# EAGLE design MRCS-SIGNAL-COMMON-DISTRIBUTION (EAGLE 7.7.0)
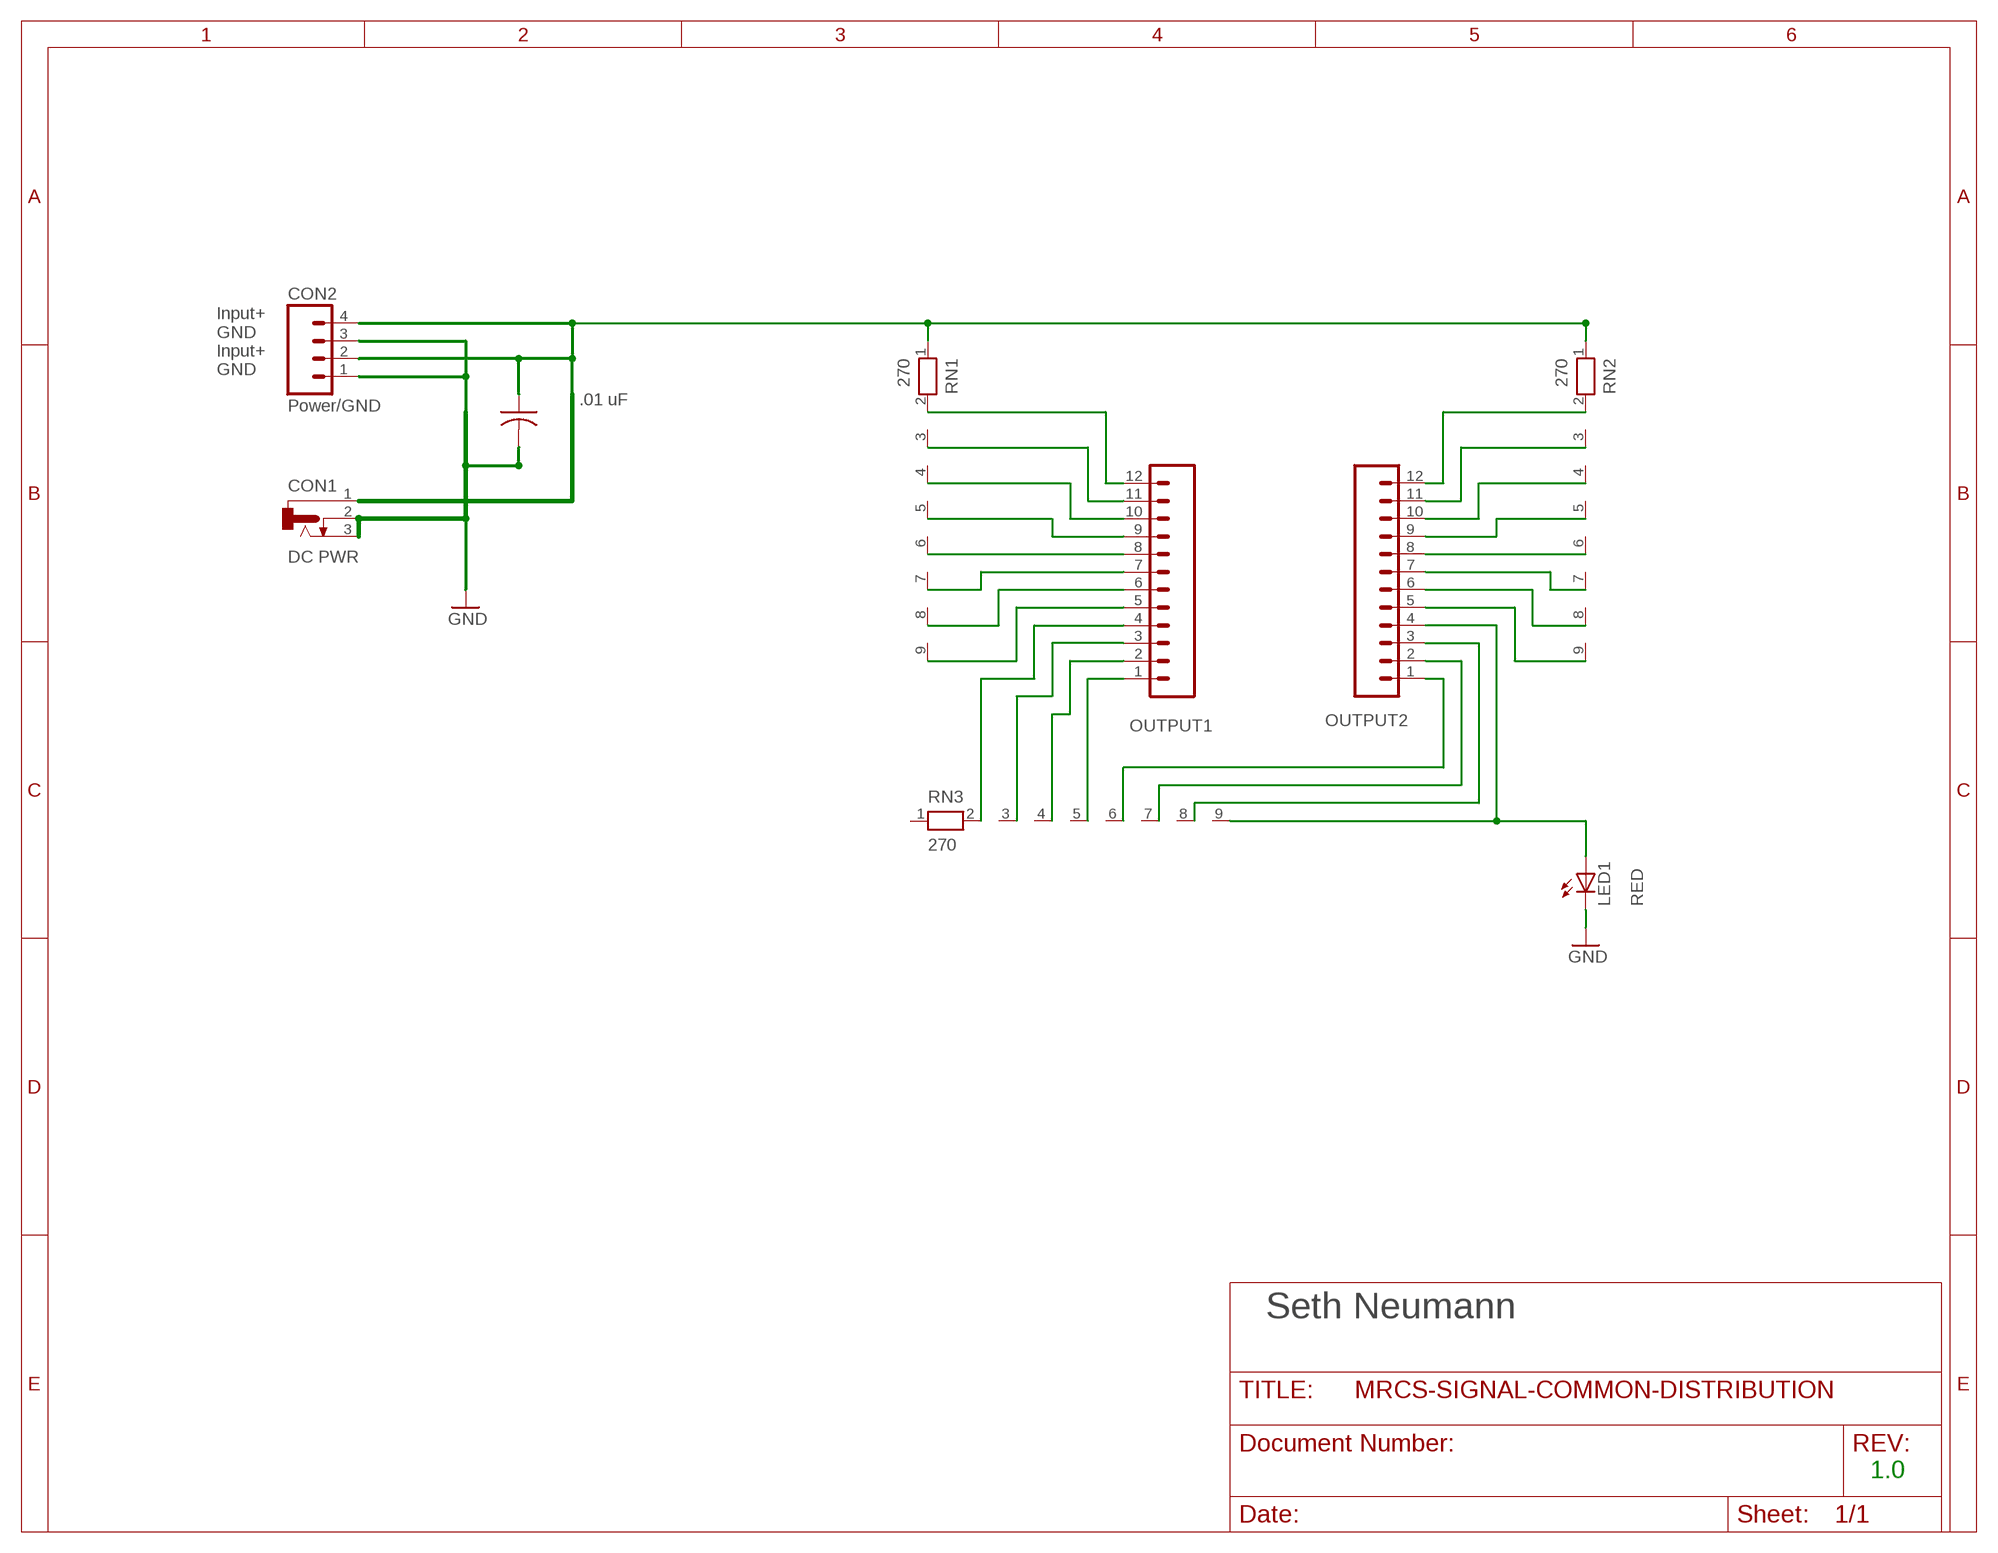
[diagram p0: schematic, sheet 1]

## Parts
C1  .01 uF  CAPPTH1  [C050-024X044]
CON1  DC PWR  CONNECTOR-DC-POWER-RA  [DCJ0202]
CON2  Power/GND  CONNECTOR-M04SCREW_LOCK  [SCREWTERMINAL-3.5MM-4_LOCK]
CON3  OUTPUT1  CONNECTOR-M12LOCK  [1X12_LOCK]
CON4  OUTPUT2  CONNECTOR-M12LOCK  [1X12_LOCK]
LED1  RED  LEDLED3MM  [LED3MM]
RN1  270  RN08  [RN-9]
RN2  270  RN08  [RN-9]
RN3  270  RN08  [RN-9]

## Nets
GND: C1.2 CON1.2 CON1.3 CON2.1 CON2.3 LED1.K(C)
INPUT+: C1.1 CON1.1 CON2.2 CON2.4 RN1.1 RN2.1
N$1: CON3.12 RN1.2
N$2: CON3.11 RN1.3
N$3: CON3.10 RN1.4
N$4: CON3.9 RN1.5
N$5: CON3.8 RN1.6
N$6: CON3.7 RN1.7
N$7: CON3.6 RN1.8
N$8: CON3.5 RN1.9
N$9: CON4.12 RN2.2
N$10: CON4.11 RN2.3
N$11: CON4.10 RN2.4
N$12: CON4.9 RN2.5
N$13: CON4.8 RN2.6
N$14: CON4.7 RN2.7
N$15: CON4.6 RN2.8
N$16: CON4.5 RN2.9
N$17: CON3.4 RN3.2
N$18: CON3.3 RN3.3
N$19: CON3.2 RN3.4
N$20: CON3.1 RN3.5
N$21: CON4.1 RN3.6
N$22: CON4.4 LED1.A RN3.9
N$23: CON4.3 RN3.8
N$24: CON4.2 RN3.7
Unconnected: RN3.1

## Notes on the sheet
- Input+
  GND
  Input+
  GND
- Seth Neumann
- 1.0

## Library data of the parts
C1 = SPCoast:CAP*
CON1 = SPCoast:CONNECTOR-DC-POWER: DC POWER JACK
CON2 = SPCoast:CONNECTOR-M04: Header 4 Standard 4-pin 0.1" header. Use with straight break away headers (SKU : PRT-00116), right angle break away headers (PRT-00553), swiss pins (PRT-00743), machine pins (PRT-00117), and female headers (PRT-00115). Molex polarized connector foot print use with SKU : PRT-08231 with associated crimp pins and housings. 1MM SMD Version SKU: PRT-10208
CON3 CON4 = SPCoast:CONNECTOR-M12: Header 12 Standard 12-pin 0.1" header. Use with straight break away headers (SKU : PRT-00116), right angle break away headers (PRT-00553), swiss pins (PRT-00743), machine pins (PRT-00117), and female headers (PRT-00115).
LED1 = SPCoast:LED*
RN1-RN3 = resistor-net:RN08: RESISTOR NETWORK; OC_FARNELL: unknown; OC_NEWARK: unknown

## Net classes
0 default: width 0.305 mm, drill 0.127 mm, clearance 0.254 mm
1 Power: width 0.61 mm, drill 0.127 mm, clearance 0.254 mm
2 Phone: width 0.406 mm, drill 0.127 mm, clearance 0.381 mm
3 Nasty Loads: width 0.61 mm, drill 0.127 mm, clearance 0.61 mm

## Board
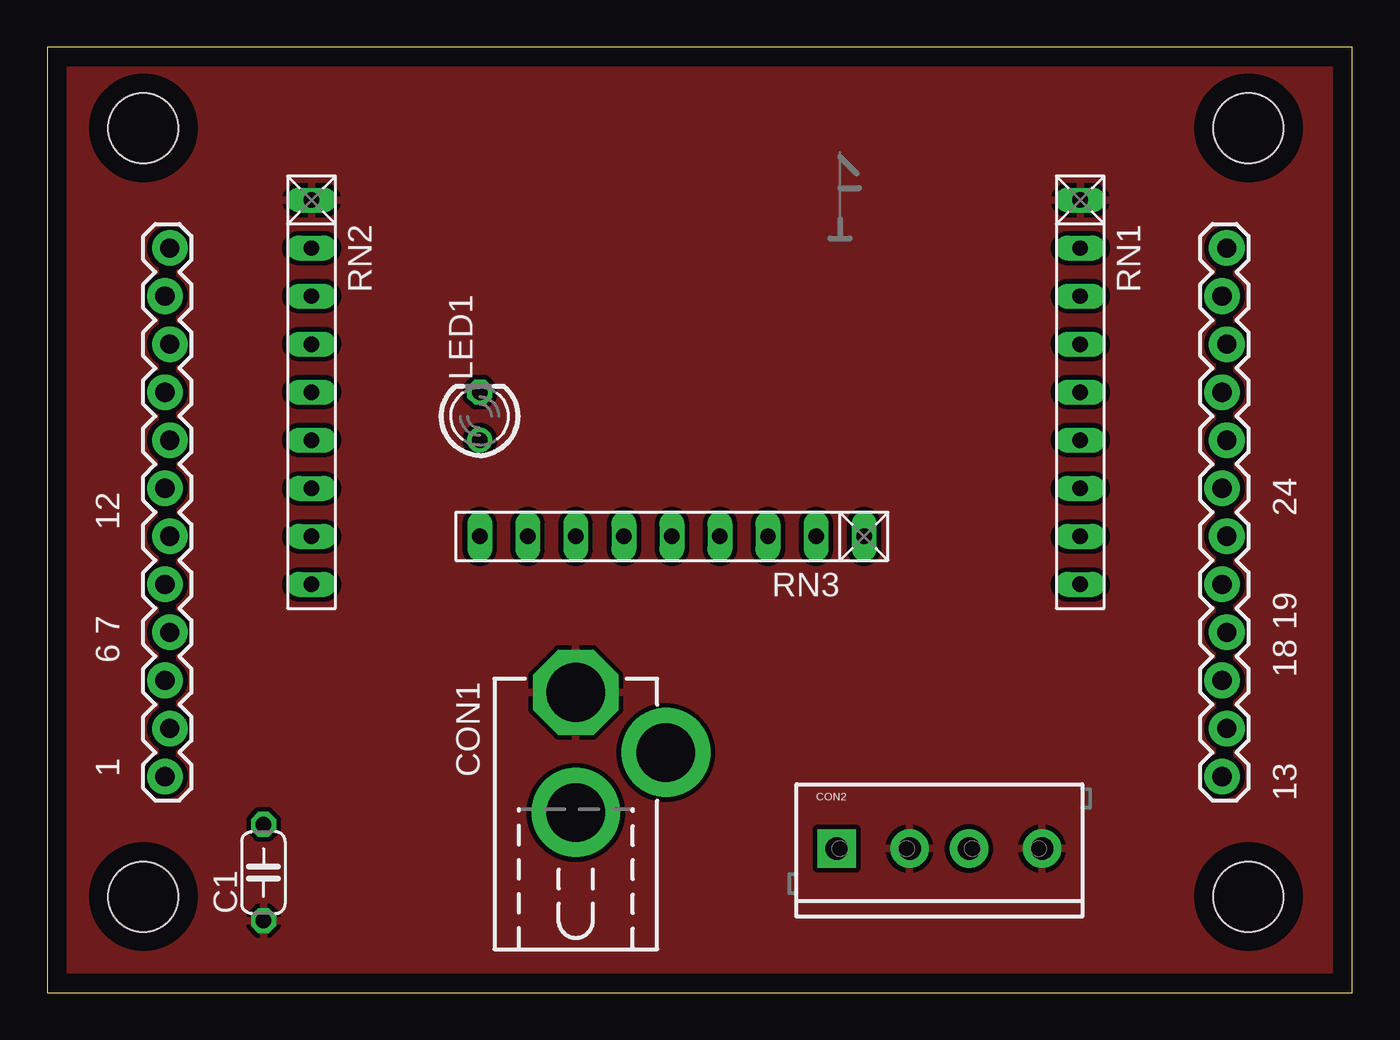
[diagram p1: board, top side]
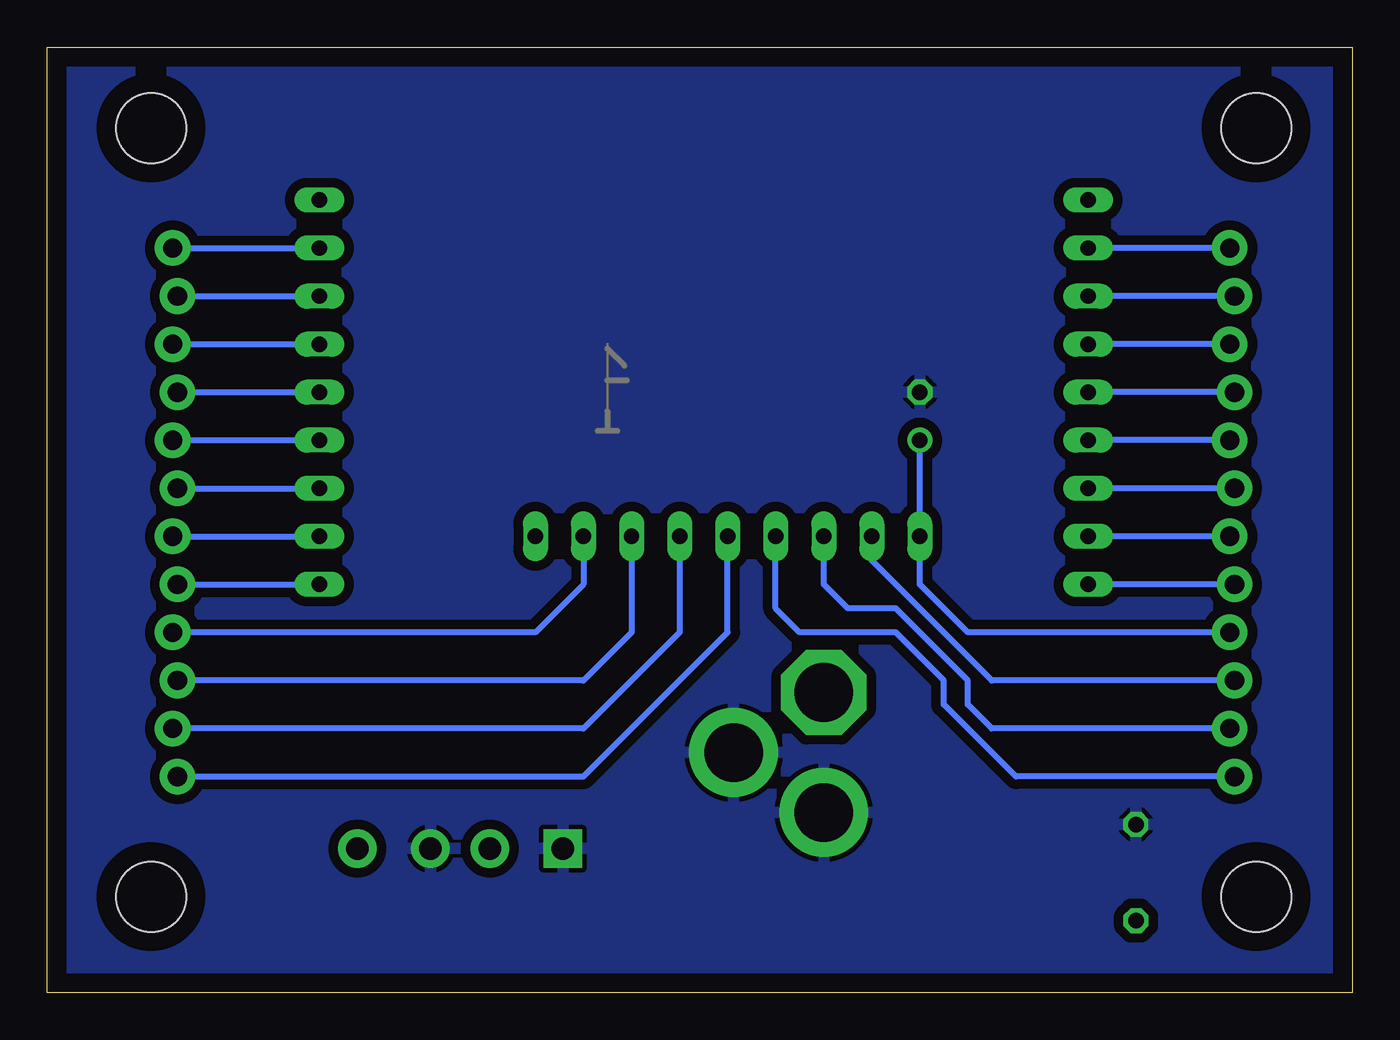
[diagram p2: board, bottom side, seen from below]

Size 68.99 x 49.99 mm. Coordinates in mm from the lower left corner, seen from the top.
Outline: 0,0 68.99,0 68.99,49.99 0,49.99 0,0
Copper layers (1*16): Top 0.035mm / dielectric 1.5mm / Bottom 0.035mm
Design rules "default": minimum track width 10mil, minimum drill 0.6mm, track to track 8mil, track to pad 8mil, pad to pad 8mil, via to via 8mil, smd to smd 8mil, copper to edge 40mil, drill to drill 8mil, minimum pad ring 10mil, minimum via ring 8mil, stop-mask expansion 4mil, vias tented up to drill 0mil, thermal gap 10mil
Holes 3.7 mm at 5.08,5.08 5.08,45.72 63.5,45.72 63.5,5.08

### Footprints (pad centres in the part's own frame; a part is rotated, then mirrored left to right if it is on the bottom)
C050-024X044 = drill 0.813 octagon: 1 -2.54,0; 2 2.54,0
DCJ0202 = drill 3.1 pad 4.5 octagon: 1 0,3.175 | drill 3.1 pad 4.7: 2 4.763,0; 3 0,-3.175
SCREWTERMINAL-3.5MM-4_LOCK = drill 1.2 pad 2.032 square: 1 -0.178,0 | drill 1.2 pad 2.032: 2 3.678,0; 3 6.822,0; 4 10.678,0
1X12_LOCK = drill 1.016 pad 1.88: 1 0,0.127; 2 2.54,-0.127; 3 5.08,0.127; 4 7.62,-0.127; 5 10.16,0.127; 6 12.7,-0.127; 7 15.24,0.127; 8 17.78,-0.127; 9 20.32,0.127; 10 22.86,-0.127; 11 25.4,0.127; 12 27.94,-0.127
LED3MM = drill 0.813: A 1.27,0 | drill 0.813 octagon: K -1.27,0
RN-9 = drill 0.813 long: 1 -10.16,0; 2 -7.62,0; 3 -5.08,0; 4 -2.54,0; 5 0,0; 6 2.54,0; 7 5.08,0; 8 7.62,0; 9 10.16,0

### Placement (x,y rotation side)
C1  11.43,6.35 90 top
CON1  27.94,12.7 0 top
CON2  41.91,7.62 0 top
CON3  62.23,11.43 90 top
CON4  6.35,11.43 90 top
LED1  22.86,30.48 270 top
RN1  54.61,31.75 270 top
RN2  13.97,31.75 270 top
RN3  33.02,24.13 180 top
U$1  [CA-PROP65WARNING]  40.64,39.37 0 top
U$2  [MRCSLOGOTOP]  40.64,39.37 0 top
U$3  [MRCSLOGOBTM]  33.02,29.21 0 top

### Tracks (layer width: path | path; a pad name or v marks a point on that pad's centre or on a via)
GND
  pour Bottom (isolate 0.508): 0,0 68.58,0 68.58,49.53 0,49.53
INPUT+
  pour Top: 0,0 68.58,0 68.58,49.53 0,49.53
N$1
  Bottom 0.305: CON3.12 RN1.2
N$2
  Bottom 0.305: CON3.11 RN1.3
N$3
  Bottom 0.305: CON3.10 RN1.4
N$4
  Bottom 0.305: CON3.9 RN1.5
N$5
  Bottom 0.305: CON3.8 RN1.6
N$6
  Bottom 0.305: CON3.7 RN1.7
N$7
  Bottom 0.305: CON3.6 RN1.8
N$8
  Bottom 0.305: CON3.5 RN1.9
N$9
  Bottom 0.305: CON4.12 RN2.2
N$10
  Bottom 0.305: CON4.11 RN2.3
N$11
  Bottom 0.305: CON4.10 RN2.4
N$12
  Bottom 0.305: CON4.9 RN2.5
N$13
  Bottom 0.305: CON4.8 RN2.6
N$14
  Bottom 0.305: CON4.7 RN2.7
N$15
  Bottom 0.305: CON4.6 RN2.8
N$16
  Bottom 0.305: CON4.5 RN2.9
N$17
  Bottom 0.305: RN3.2 40.64,21.59 43.18,19.05 CON3.4
N$18
  Bottom 0.305: RN3.3 38.1,19.05 40.64,16.51 CON3.3 62.23,16.51
N$19
  Bottom 0.305: RN3.4 35.56,19.05 40.64,13.97 CON3.2
N$20
  Bottom 0.305: CON3.1 40.64,11.43 33.02,19.05 RN3.5
N$21
  Bottom 0.305: CON4.1 17.78,11.43 21.59,15.24 21.59,16.51 24.13,19.05 29.21,19.05 30.48,20.32 RN3.6
N$22
  Bottom 0.305: CON4.4 20.32,19.05 22.86,21.59 RN3.9 LED1.A
N$23
  Bottom 0.305: CON4.3 19.05,16.51 25.4,22.86 RN3.8
N$24
  Bottom 0.305: RN3.7 27.94,21.59 26.67,20.32 24.13,20.32 20.32,16.51 20.32,15.24 19.05,13.97 CON4.2

### Text on the board
tPlace: 1 6 7 12 | 13 18 19 24
tDocu: Signal Common Distribution / Seth Neumann / 20240126 / V 1.0 | G + G +